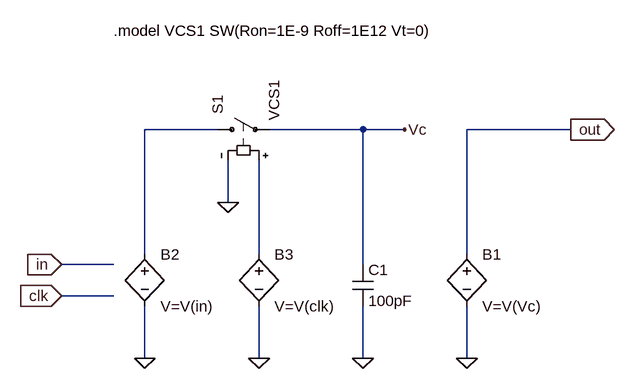
[diagram p0: schematic S&H.asc]
S&H.asc, the LTspice schematic file:
Version 4
SHEET 1 880 680
WIRE -16 0 -128 0
WIRE 208 0 64 0
WIRE 272 0 208 0
WIRE 528 0 368 0
WIRE 0 112 0 48
WIRE -128 192 -128 0
WIRE 48 192 48 48
WIRE 368 192 368 0
WIRE -176 208 -256 208
WIRE 208 208 208 0
WIRE -176 256 -256 256
WIRE -128 352 -128 272
WIRE 48 352 48 272
WIRE 208 352 208 272
WIRE 368 352 368 272
FLAG 0 112 0
FLAG 208 352 0
FLAG 368 352 0
FLAG 272 0 Vc
FLAG -256 208 in
IOPIN -256 208 In
FLAG -256 256 clk
IOPIN -256 256 In
FLAG -128 352 0
FLAG 48 352 0
FLAG 528 0 out
IOPIN 528 0 Out
SYMBOL sw -32 0 R270
WINDOW 3 13 103 Left 0
SYMATTR Value VCS1
SYMATTR InstName S1
SYMBOL cap 192 208 R0
SYMATTR InstName C1
SYMATTR Value 100pF
SYMBOL bv 368 176 R0
SYMATTR InstName B1
SYMATTR Value V=V(Vc)
SYMBOL bv -128 176 R0
SYMATTR InstName B2
SYMATTR Value V=V(in)
SYMBOL bv 48 176 R0
SYMATTR InstName B3
SYMATTR Value V=V(clk)
TEXT -176 -152 Left 0 !.model VCS1 SW(Ron=1E-9 Roff=1E12 Vt=0)

The netlist it stands for:
* S&H.asc
S1 N001 Vc N002 0 VCS1
C1 Vc 0 100pF
B1 out 0 V=V(Vc)
B2 N001 0 V=V(in)
B3 N002 0 V=V(clk)
.model VCS1 SW(Ron=1E-9 Roff=1E12 Vt=0)
.backanno
.end